# Altium schematic sheet Connectors.SchDoc
size A; SheetNumber: 2; SheetTotal: 3
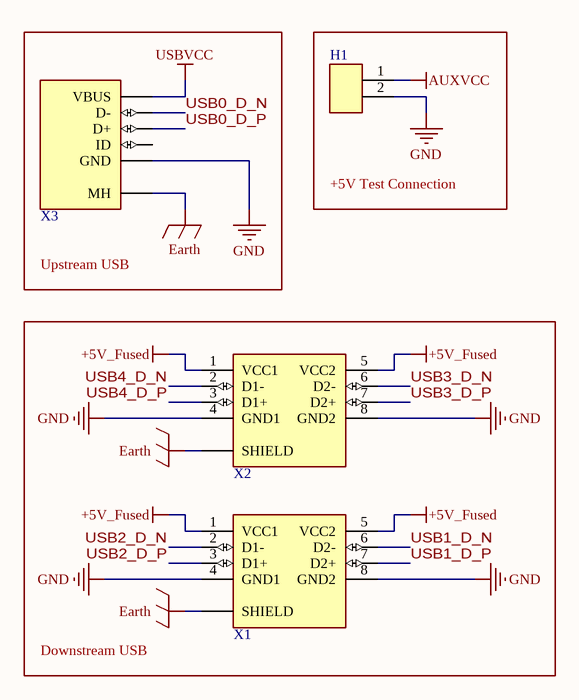
[diagram p0: Connectors.SchDoc]

## Parts
H1  1x2 Header  [[Header] 1x2 Male]  (value not drawn)
X1  USB-A  [[USB] Type-A Dual]  (value not drawn)
X2  USB-A  [[USB] Type-A Dual]  (value not drawn)
X3  [USB] Type-B Mini  [[USB] Type-B Mini]  (value not drawn)

## Blocks framed on the sheet
Upstream USB: X3
+5V Test Connection: H1
Downstream USB: X1 X2

## Nets
+5V_Fused: X1.1(VCC1) X1.5(VCC2) X2.1(VCC1) X2.5(VCC2)
AUXVCC: H1.1
Earth: X1.MH(SHIELD) X2.MH(SHIELD) X3.MH
GND: H1.2 X1.4(GND1) X1.8(GND2) X2.4(GND1) X2.8(GND2) X3.5(GND)
USBVCC: X3.1(VBUS)
USB0_D_N: X3.2(D-)
USB0_D_P: X3.3(D+)
USB1_D_N: X1.6(D2-)
USB1_D_P: X1.7(D2+)
USB2_D_N: X1.2(D1-)
USB2_D_P: X1.3(D1+)
USB3_D_N: X2.6(D2-)
USB3_D_P: X2.7(D2+)
USB4_D_N: X2.2(D1-)
USB4_D_P: X2.3(D1+)

Not connected (* = marked no-connect by the designer): X3 4(ID)

## Library data of the parts
H1 = [Header] 1x2 Male: 2.54mm pitch
X1 X2 = [USB] Type-A Dual: 61400826021; Supplier 1: DigiKey; Supplier Part Number 1: 2092-KUSBX-AS2N-B-ND
X3 = [USB] Type-B Mini: MUSB-05-S-B-SM-A-K-TR; Supplier 1: DigiKey; Supplier Part Number 1: SAM14226CT-ND